# EAGLE design OSO-MISC-20-027 AirLift Adapter for Sensor Cap (EAGLE 9.6.2)
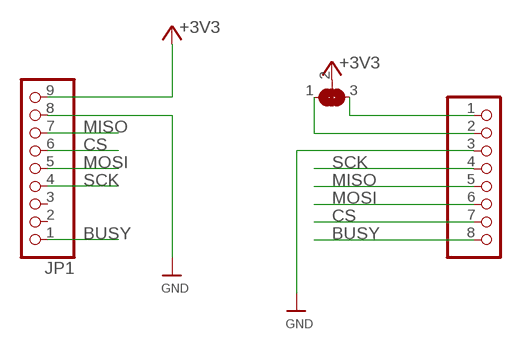
[diagram p0: schematic, sheet 1]

## Parts
JP1  HEADER-1X9_JSTSH  [JST_SH9]
JP2  PINHD-1X8/90  [1X08/90]
SJ1  SOLDERJUMPER_2WAY  [SOLDERJUMPER_2WAY_OPEN_NOPASTE]

## Nets
+3V3: JP1.9 SJ1.2
BUSY: JP1.1 JP2.8
CS: JP1.6 JP2.7
GND [gnd]: JP1.8 JP2.3
MISO: JP1.7 JP2.5
MOSI: JP1.5 JP2.6
N$1: JP2.2 SJ1.1
N$2: JP2.1 SJ1.3
SCK: JP1.4 JP2.4
Unconnected: JP1.2 JP1.3

## Library data of the parts
JP1 = microbuilder:HEADER-1X9: PIN HEADER
JP2 = pinhead-round:PINHD-1X8: PIN HEADER
SJ1 = Adafruit MONSTER M4SK:SOLDERJUMPER_2WAY: 2-Way Solder Jumper

## Net classes
0 default: width 0.152 mm, drill 0.254 mm
1 power: width 0.305 mm, drill 0.305 mm

## Board
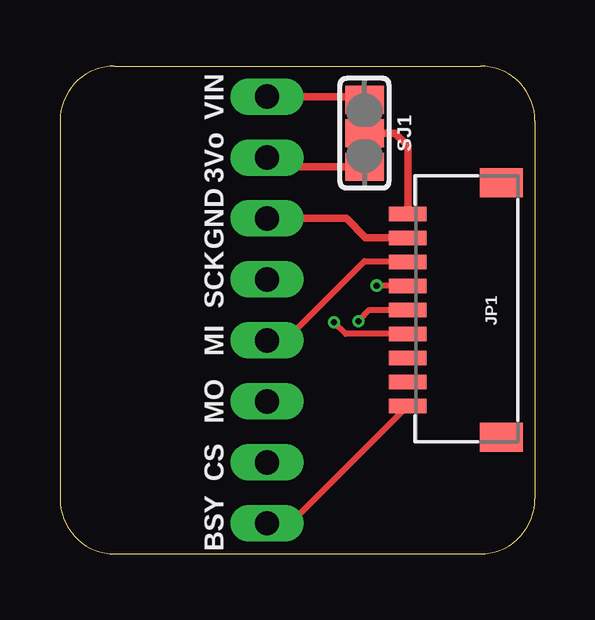
[diagram p1: board, top side]
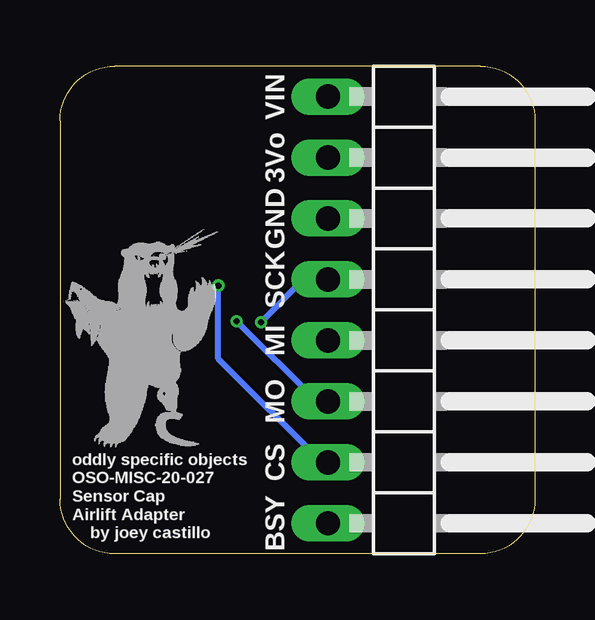
[diagram p2: board, bottom side, seen from below]

Size 19.81 x 20.32 mm. Coordinates in mm from the lower left corner, seen from the top.
Outline: 19.81,18.03 arc90 17.53,20.32 2.29,20.32 arc90 0,18.03 0,2.29 arc90 2.29,0 17.53,0 arc90 19.81,2.29 19.81,18.03
Copper layers (1*16): Top 0.035559375mm / dielectric 1.6mm / Bottom 0.035559375mm
Design rules "oshpark-2layer *": minimum track width 6mil, minimum drill 10mil, track to track 6mil, track to pad 6mil, pad to pad 6mil, via to via 6mil, smd to smd 6mil, copper to edge 15mil, drill to drill 6mil, minimum pad ring 5mil, minimum via ring 5mil, stop-mask expansion 2.5mil, vias tented up to drill 12mil, thermal gap 10mil

### Footprints (pad centres in the part's own frame; a part is rotated, then mirrored left to right if it is on the bottom)
JST_SH9 = smd 0.6 x 1.55: 1 -4,2.514; 2 -3,2.514; 3 -2,2.514; 4 -1,2.514; 5 0,2.514; 6 1,2.514; 7 2,2.514; 8 3,2.514; 9 4,2.514 | smd 1.2 x 1.8: MT1 -5.3,-1.386; MT2 5.3,-1.386
1X08/90 = drill 1.016 long: 1 -8.89,-3.81; 2 -6.35,-3.81; 3 -3.81,-3.81; 4 -1.27,-3.81; 5 1.27,-3.81; 6 3.81,-3.81; 7 6.35,-3.81; 8 8.89,-3.81
SOLDERJUMPER_2WAY_OPEN_NOPASTE = smd 1.168 x 1.6: 1 -1.397,0; 2 0,0; 3 1.397,0

### Placement (x,y rotation side)
JP1  17.02,10.16 90 top
JP2  4.83,10.16 270 bottom
SJ1  12.7,17.53 90 top
U$2  [OSO_BEAR_250X360MIL_1000DPI]  16.38,9.02 0 bottom

### Tracks (layer width: path | path; a pad name or v marks a point on that pad's centre or on a via)
+3V3
  Top 0.305: SJ1.2 13.97,17.53 14.5,16.99 JP1.9
BUSY
  Top 0.254: JP2.8 9.61,1.27 JP1.1
CS  (via drill 0.25)
  Top 0.254: JP1.6 13.22,11.16 v13.21,11.18
  Bottom 0.254: JP2.7 8.89,3.81 13.21,8.13 v13.21,11.18
GND
  Top 0.305: JP1.8 12.75,13.16 11.94,13.97 JP2.3
MISO
  Top 0.254: JP2.5 9.4,8.89 12.7,12.19 14.47,12.19 JP1.7
MOSI  (via drill 0.25)
  Top 0.254: v12.45,9.69 12.91,10.16 JP1.5
  Bottom 0.254: JP2.6 9.1,6.35 v12.45,9.69
N$1
  Top 0.305: JP2.2 9.02,16.13 SJ1.1
N$2
  Top 0.305: JP2.1 12.57,19.05 SJ1.3
SCK  (via drill 0.25)
  Top 0.254: JP1.4 11.92,9.16 v11.43,9.65
  Bottom 0.254: v11.43,9.65 9.65,11.43 JP2.4

### Text on the board
tPlace: VIN | 3Vo | GND | SCK | MI | MO | CS | BSY
bPlace: VIN | 3Vo | GND | SCK | MI | MO | CS | oddly specific objects / OSO-MISC-20-027 / Sensor Cap / Airlift Adapter / by joey castillo | BSY